# Altium schematic sheet HW_HDSP2072.SchDoc
size A3
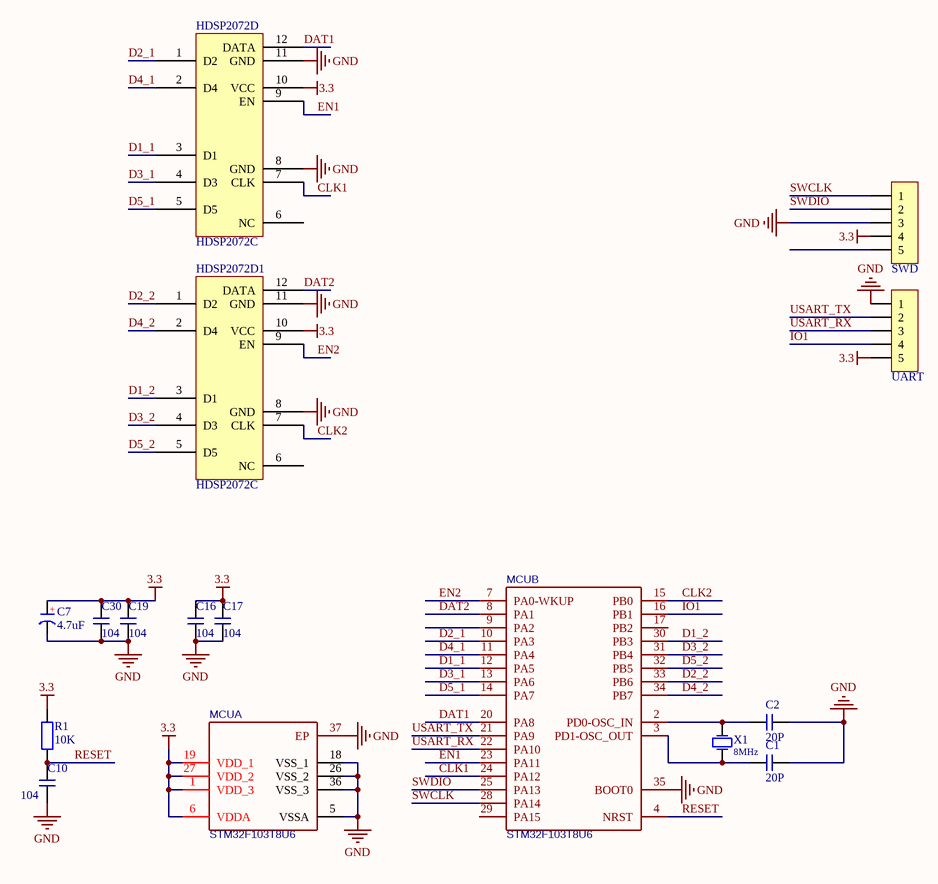
[diagram p0: HW_HDSP2072.SchDoc]

## Parts
C1  20P  [0603C]
C2  20P  [0603C]
C7  4.7uF  [3528-B-TA]
C10  104  [0603C]
C16  104  [0603C]
C17  104  [0603C]
C19  104  [0603C]
C30  104  [0603C]
HDSP2072D  HDSP2072C  [HDSP2072SH]
HDSP2072D1  HDSP2072C  [HDSP2072SH]
MCU  STM32F103T8U6  [VFQFPN36_L6.0-W6.0-P0.50-BL-EP3.7]  (parts A,B of 2)
R1  10K  [0603R]
SWD  HDR-1X5  [HDR2.54-LI-5P]  (value not drawn)
UART  HDR-1X5  [HDR2.54-LI-5P]  (value not drawn)
X1  value 8MHz  [OSC 5032-2P]  (hidden comment: 1.6.1.01.005.001)

## Nets
3.3: C7.1(A) C16.1 C17.1 C19.1 C30.1 HDSP2072D.10(VCC) HDSP2072D1.10(VCC) MCU.1(VDD_3) MCU.6(VDDA) MCU.19(VDD_1) MCU.27(VDD_2) R1.1 SWD.4 UART.5
GND: C1.1 C2.1 C7.2(K) C10.2 C16.2 C17.2 C19.2 C30.2 HDSP2072D.8(GND) HDSP2072D.11(GND) HDSP2072D1.8(GND) HDSP2072D1.11(GND) MCU.5(VSSA) MCU.18(VSS_1) MCU.26(VSS_2) MCU.35(BOOT0) MCU.36(VSS_3) MCU.37(EP) SWD.3 UART.1
CLK1: HDSP2072D.7(CLK) MCU.24(PA12)
CLK2: HDSP2072D1.7(CLK) MCU.15(PB0)
D1_1: HDSP2072D.3(D1) MCU.12(PA5)
D1_2: HDSP2072D1.3(D1) MCU.30(PB3)
D2_1: HDSP2072D.1(D2) MCU.10(PA3)
D2_2: HDSP2072D1.1(D2) MCU.33(PB6)
D3_1: HDSP2072D.4(D3) MCU.13(PA6)
D3_2: HDSP2072D1.4(D3) MCU.31(PB4)
D4_1: HDSP2072D.2(D4) MCU.11(PA4)
D4_2: HDSP2072D1.2(D4) MCU.34(PB7)
D5_1: HDSP2072D.5(D5) MCU.14(PA7)
D5_2: HDSP2072D1.5(D5) MCU.32(PB5)
DAT1: HDSP2072D.12(DATA) MCU.20(PA8)
DAT2: HDSP2072D1.12(DATA) MCU.8(PA1)
EN1: HDSP2072D.9(EN) MCU.23(PA11)
EN2: HDSP2072D1.9(EN) MCU.7(PA0-WKUP)
IO1: MCU.16(PB1) UART.4
RESET: C10.1 MCU.4(NRST) R1.2
SWCLK: MCU.28(PA14) SWD.1
SWDIO: MCU.25(PA13) SWD.2
USART_RX: MCU.22(PA10) UART.3
USART_TX: MCU.21(PA9) UART.2
NetC1_2: C1.2 MCU.3(PD1-OSC_OUT) X1.2(OSC2)
NetC2_2: C2.2 MCU.2(PD0-OSC_IN) X1.1(OSC1)

Not connected (* = marked no-connect by the designer): HDSP2072D 6(NC); HDSP2072D1 6(NC); MCU 9(PA2) 17(PB2) 29(PA15); SWD 5

## Notes on the sheet
- (in symbol C-CD) +

## Library data of the parts
C1 C2 C10 C16 C17 C19 C30 = 电容
C7 = C-CD: 贴片钽电容; 版权归属: 源创客; BOM名称: 贴片钽电容; 学习资源: www.ooocke.com
HDSP2072D HDSP2072D1 = HDSP2072
MCU = STM32F103T8U6: BOM_Manufacturer: ST; subpart_no: 2; tags: STM32; BOM_Supplier Part: C19671; BOM_Supplier: LCSC; BOM_Manufacturer Part: STM32F103T8U6; image: http://image.lceda.cn/szlcsc/C19671.jpg; spicePre: U; spiceSymbolName: STM32F103T8U6
R1 = R: 贴片电阻; 版权归属: 源创客; BOM名称: 贴片电阻; 学习资源: www.ooocke.com
SWD UART = Header 5: 5P接插件; 版权归属: 源创客; BOM名称: 5P接插件; 学习资源: www.ooocke.com
X1 = 1.6.1.01.005.001: XTAL,8MHz,±20PPM,12.6*4.5; K3 No.: 1.6.1.01.005.001; GENERAL: *